# Altium schematic sheet DSO_Front.SchDoc: Schematic_Name
size A4; CompanyName: University of Melbourne; Engineer: Your Name Here; DocumentNumber: 1; Revision: 0.1; SheetNumber: 2; SheetTotal: 11; Title_Project: Project_Title; StudentNo: Student No.
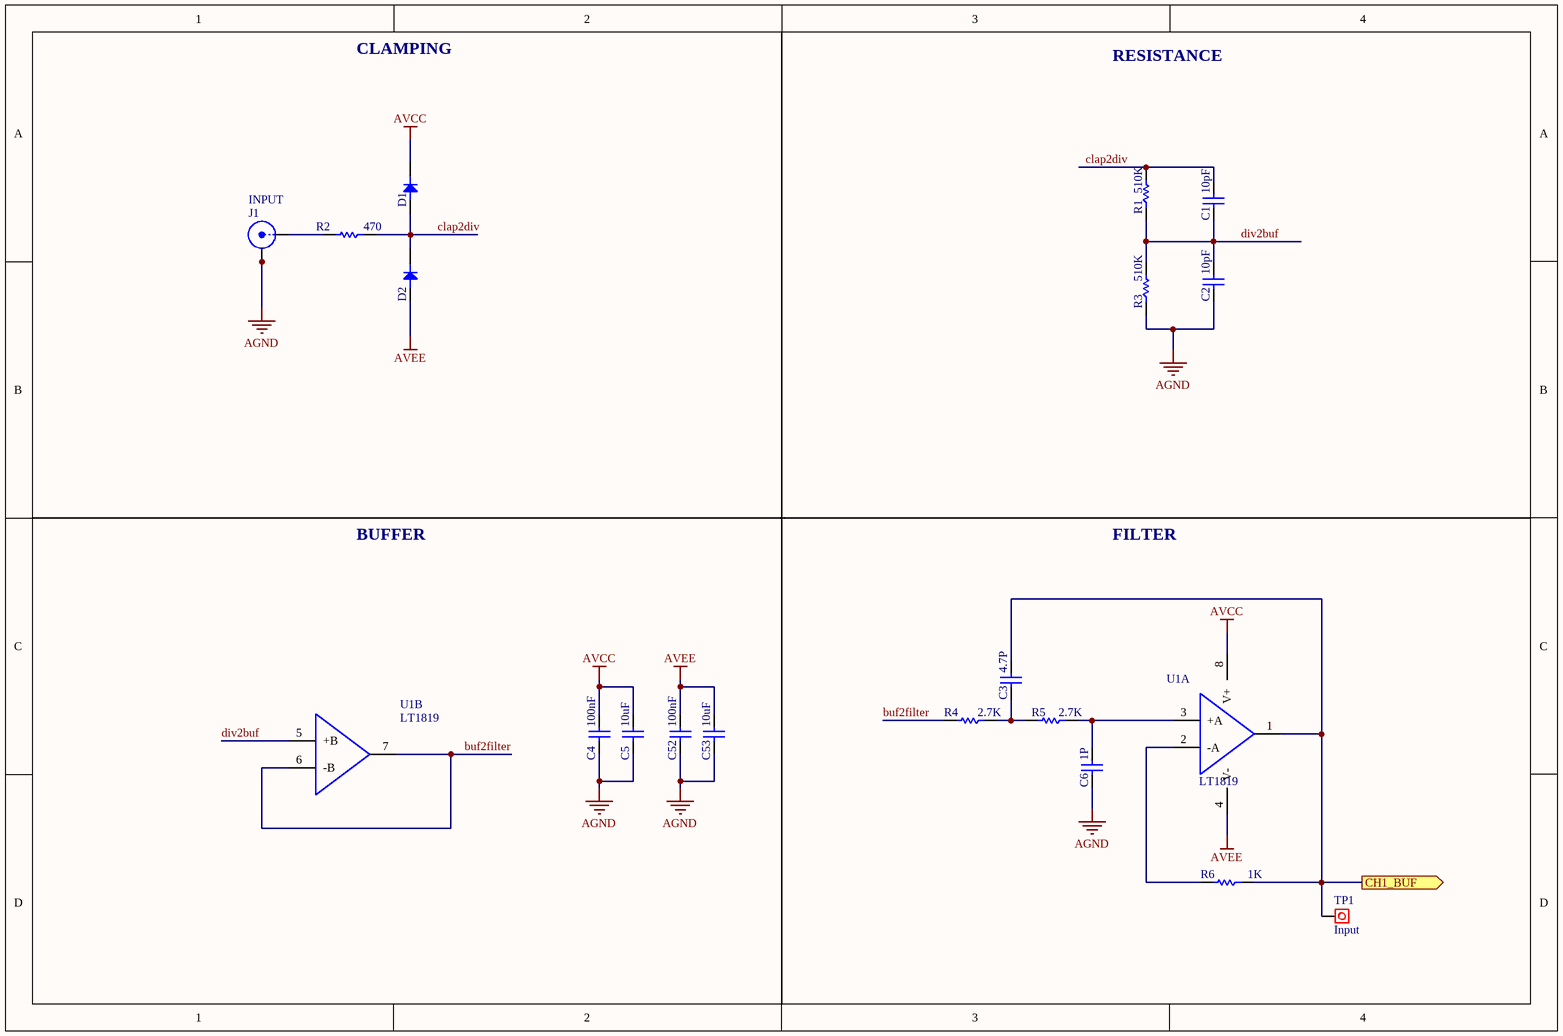
[diagram p0: DSO_Front.SchDoc]

## Parts
C1  10pF  [0805C]
C2  10pF  [0805C]
C3  4.7P  [0805C]
C4  100nF  [0805C]
C5  10uF  [0805C]
C6  1P  [0805C]
C52  100nF  [0805C]
C53  10uF  [0805C]
D1  Diode  [SOD-123]  (value not drawn)
D2  Diode  [SOD-123]  (value not drawn)
J1  INPUT  [BNC_VERT]
R1  510K  [0805]
R2  470  [0805]
R3  510K  [0805]
R4  2.7K  [0805]
R5  2.7K  [0805]
R6  1K  [0805]
TP1  INPUT  [Testpoin]
U1  LT1819  [SOIC-8]  (parts A,B of 2)

## Ports
CH1_BUF (out)

## Nets
AGND: C2.2 C4.2 C5.2 C6.2 C52.2 C53.2 J1.2(Y) J1.3(Y) J1.4(Y) J1.5(Y) R3.1
AVCC: C4.1 C5.1 D1.K U1.8(V+)
AVEE: C52.1 C53.1 D2.A U1.4(V-)
buf2filter: R4.2 U1.6(-B) U1.7(OUTB)
CH1_BUF: C3.1 R6.1 TP1.1 U1.1(OUTA) ; port CH1_BUF
clap2div: C1.1 D1.A D2.K R1.2 R2.1
div2buf: C1.2 C2.1 R1.1 R3.2 U1.5(+B)
NetC3_2: C3.2 R4.1 R5.2
NetC6_1: C6.1 R5.1 U1.3(+A)
NetJ1_1: J1.1(X) R2.2
NetR6_2: R6.2 U1.2(-A)

## Notes on the sheet
- CLAMPING
- RESISTANCE
- BUFFER
- FILTER

## Library data of the parts
C1-C6 C52 C53 = C: Capacitor; Reviewed by: RM - 2018/08/05; Revision: July-2002: Re-released for DXP Platform.; Supplier 1: *; Supplier Part Number 1: *
  C1 C2: Value: 10pF
  C3: Value: 4.7P
  C4 C52: Value: 100nF
  C5 C53: Value: 10uF
  C6: Value: 1P
D1 D2 = D: Reviewed by: RM - 2018/08/05; Revision: July-2002: Re-released for DXP Platform.; Supplier 1: *; Supplier Part Number 1: *
J1 = BNC: BNC Straight; Reviewed by: RM - 2018/08/05; Supplier Part Number 1: A97581-ND; Supplier 1: Digi-Key
R1-R6 = R: Resistor; Reviewed by: RM - 2018/08/05; Supplier 1: *; Suppler Part Number 1: *
  R1 R3: Value: 510K
  R2: Value: 470
  R4 R5: Value: 2.7K
  R6: Value: 1K
TP1 = Test Point: Pad; Value: Input
U1 = LT1819: OpAmp High Frequency Dual; Reviewed by: RM - 2018/08/05; Supplier 1: Digi-Key; Supplier Part Number 1: LT1819CMS8#PBF-ND